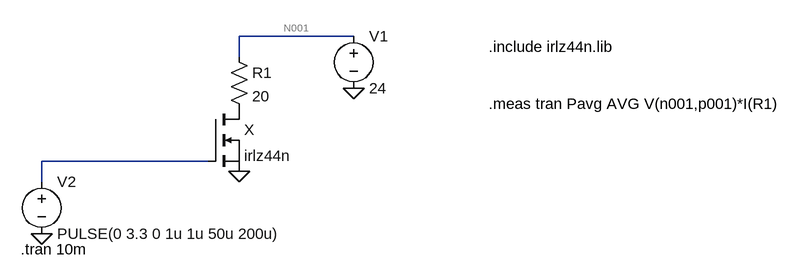
[diagram p0: schematic pwm_test.asc]
pwm_test.asc, the LTspice schematic file:
Version 4.1
SHEET 1 1580 1596
WIRE -688 -128 -864 -128
WIRE -864 -96 -864 -128
WIRE -912 64 -1168 64
WIRE -1168 96 -1168 64
FLAG -688 -48 0
FLAG -864 80 0
FLAG -1168 176 0
SYMBOL nmos -912 -16 R0
SYMATTR InstName X
SYMATTR Value irlz44n
SYMATTR Prefix X
SYMBOL voltage -688 -144 R0
WINDOW 123 0 0 Left 0
WINDOW 39 0 0 Left 0
SYMATTR InstName V1
SYMATTR Value 24
SYMBOL res -880 -112 R0
SYMATTR InstName R1
SYMATTR Value 20
SYMATTR SpiceLine pwr=20
SYMBOL voltage -1168 80 R0
WINDOW 123 0 0 Left 0
WINDOW 39 0 0 Left 0
SYMATTR InstName V2
SYMATTR Value PULSE(0 3.3 0 1u 1u 50u 200u)
TEXT -480 -112 Left 2 !.include irlz44n.lib
TEXT -1200 200 Left 2 !.tran 10m
TEXT -480 -24 Left 2 !.meas tran Pavg AVG V(n001,p001)*I(R1)

The netlist it stands for:
* pwm_test.asc
X§X P001 N002 0 irlz44n  ; pins D G S
V1 N001 0 24
R1 N001 P001 20 pwr=20
V2 N002 0 PULSE(0 3.3 0 1u 1u 50u 200u)
.include irlz44n.lib
.tran 10m
.meas tran Pavg AVG V(n001,p001)*I(R1)
.backanno
.end